# Altium schematic sheet BHS_Circuit.SchDoc
size A4; SheetNumber: 1; SheetTotal: 1
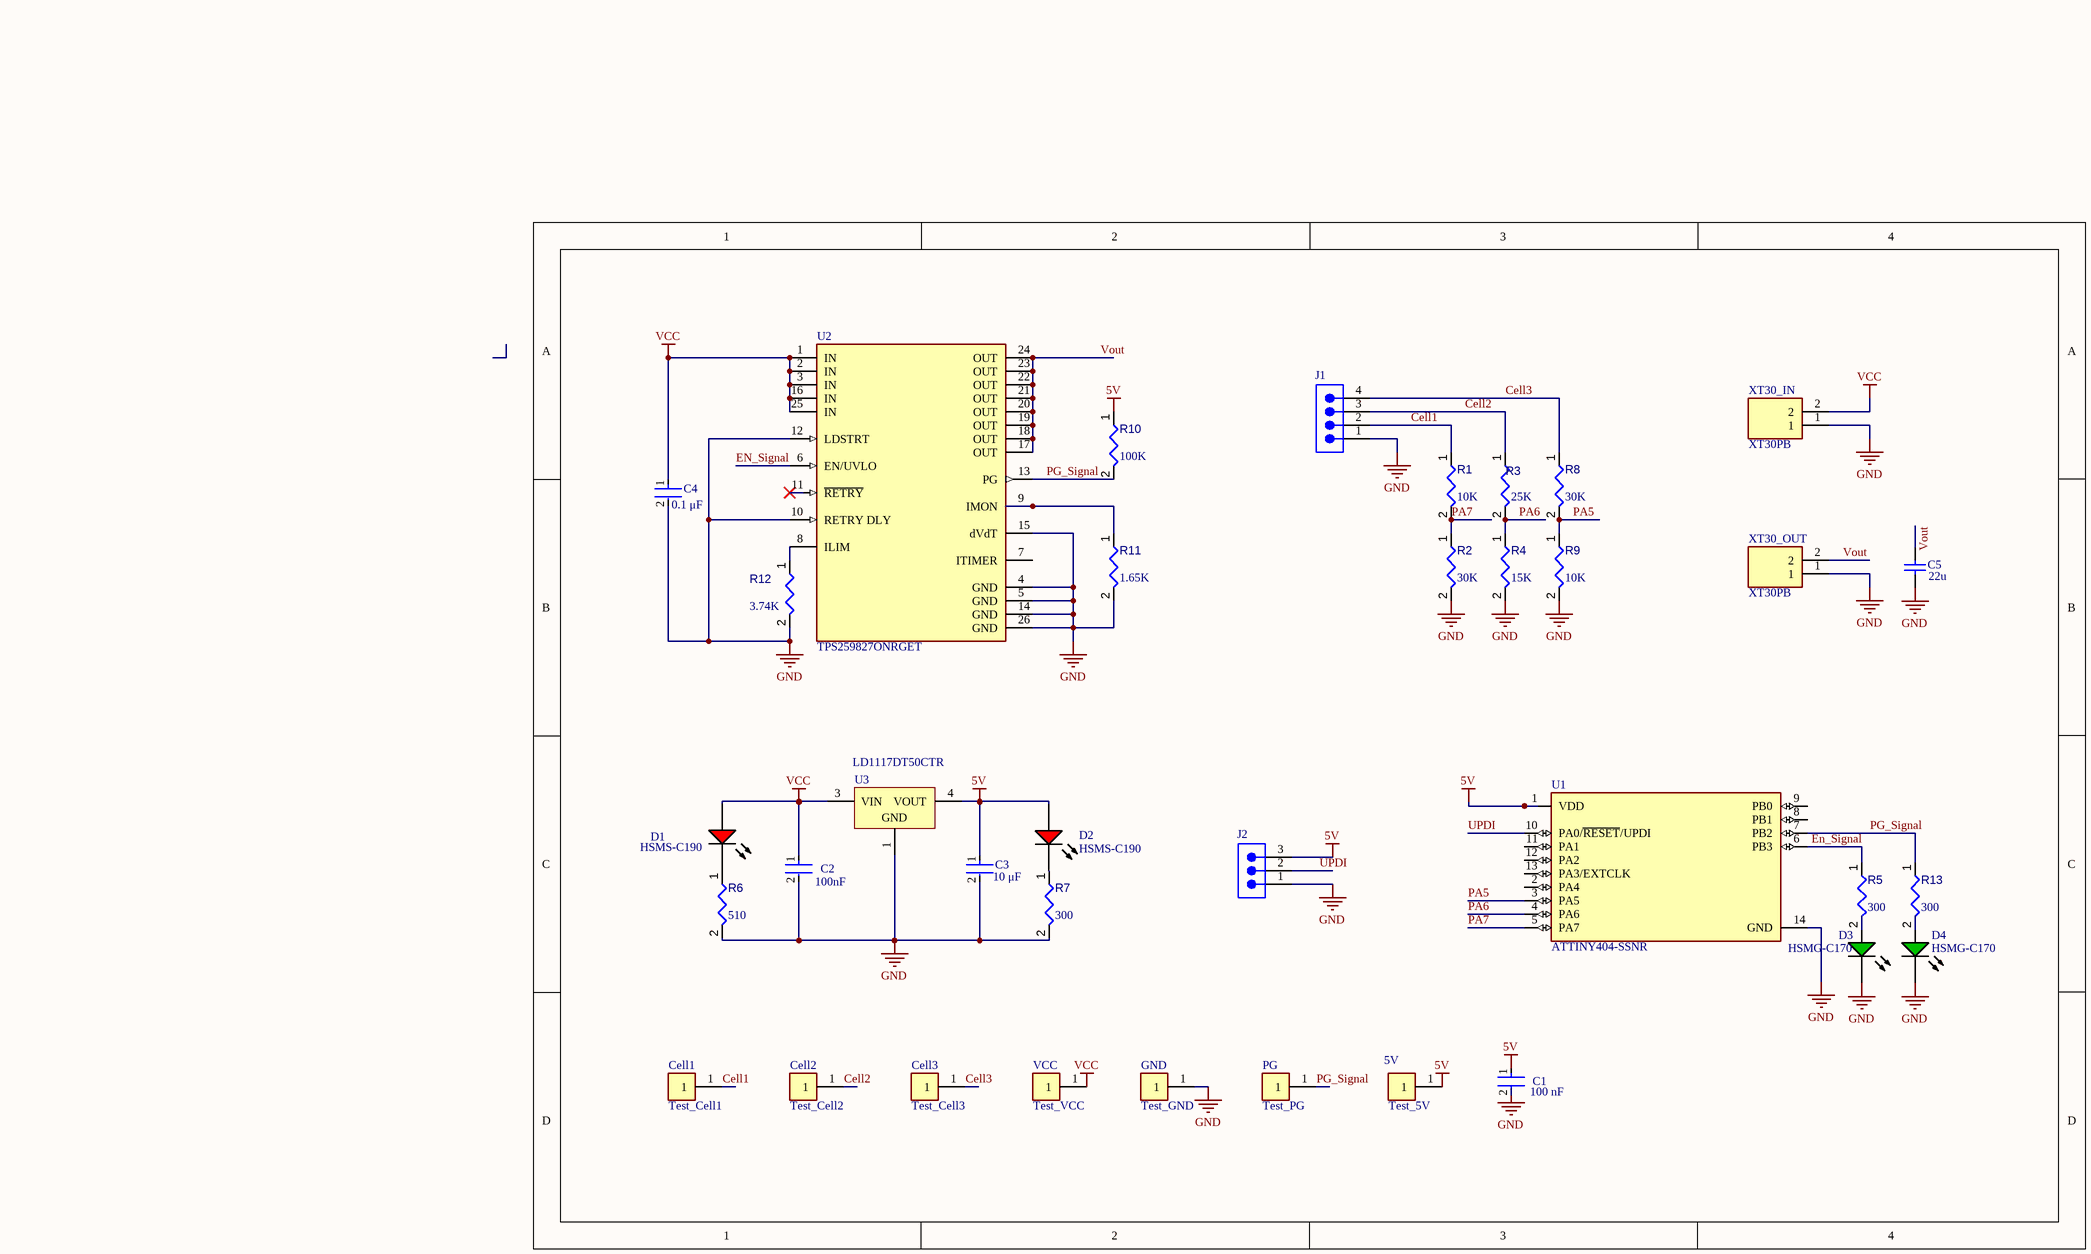
[diagram p0: BHS_Circuit.SchDoc]

## Parts
5V  Test_5V  [FP-5001-MFG]
C1  value 100 nF  [FP-C0805C-DN-MFG]  (hidden comment: CL21B104KBCNNNC)
C2  value 100nF  [FP-C0805C-DN-MFG]  (hidden comment: CL21B104KBCNNNC)
C3  value 10 μF  [FP-C0805C-DN-MFG]  (hidden comment: CL21A106KOQNNNE)
C4  value 0.1 μF  [FP-C0805C-DN-MFG]  (hidden comment: CL21B104KBCNNNC)
C5  Part Number: 22u  [CAPC2014X150X70NL20]  (hidden comment: CL21A226MOCLRNC)
Cell1  Test_Cell1  [FP-5001-MFG]
Cell2  Test_Cell2  [FP-5001-MFG]
Cell3  Test_Cell3  [FP-5001-MFG]
D1  HSMS-C190  [AVAG-HSMX-C190_V]
D2  HSMS-C190  [AVAG-HSMX-C190_V]
D3  HSMG-C170  [AVAG-HSMX-C170_V]
D4  HSMG-C170  [AVAG-HSMX-C170_V]
GND  Test_GND  [FP-5001-MFG]
J1  (no value)  [61300411121]
J2  (no value)  [61300311121]
PG  Test_PG  [FP-5001-MFG]
R1  value 10K  [RESC0805(2012)_L]  (hidden comment: RMCF0805FT10K0)
R2  value 30K  [RESC0805(2012)_L]  (hidden comment: RC0805DR-0730KL)
R3  value 25K  [RESC0805(2012)_L]
R4  value 15K  [RESC0805(2012)_L]  (hidden comment: SR0805JR-0715KL)
R5  value 300  [RESC0805(2012)_L]  (hidden comment: ERJ6GEYJ301V)
R6  value 510  [RESC0805(2012)_L]  (hidden comment: CR-05JA7--510R)
R7  value 300  [RESC0805(2012)_L]  (hidden comment: ERJ6GEYJ301V)
R8  value 30K  [RESC0805(2012)_L]  (hidden comment: RC0805DR-0730KL)
R9  value 10K  [RESC0805(2012)_L]  (hidden comment: RMCF0805FT10K0)
R10  value 100K  [RESC0805(2012)_L]  (hidden comment: RMCF0805FT100K)
R11  value 1.65K  [RESC0805(2012)_L]
R12  value 3.74K  [RESC0805(2012)_L]  (hidden comment: RC0805FR-073K74L)
R13  value 300  [RESC0805(2012)_L]  (hidden comment: ERJ6GEYJ301V)
U1  ATTINY404-SSNR  [FP-C04-065-D3X-IPC_C]
U2  TPS259827ONRGET  [FP-RGE0024M-MFG]
U3  LD1117DT50CTR  [TO-252_N]
VCC  Test_VCC  [FP-5001-MFG]
XT30_IN  XT30PB  [XT30PB]
XT30_OUT  XT30PB  [XT30PB]

## Nets
5V: 5V.1 C1.1 C3.1 D2.1(A) J2.3 R10.1 U1.1(VDD) U3.4(VOUT)
GND: C1.2 C2.2 C3.2 C4.2 C5.1 D3.2(K) D4.2(K) GND.1 J1.1 J2.1 R2.2 R4.2 R6.2 R7.2 R9.2 R11.2 R12.2 U1.14(GND) U2.4(GND) U2.5(GND) U2.10(RETRY_DLY) U2.12(LDSTRT) U2.14(GND) U2.15(dVdT) U2.26(GND) U3.1(GND) XT30_IN.1 XT30_OUT.1
VCC: C2.1 C4.1 D1.1(A) U2.1(IN) U2.2(IN) U2.3(IN) U2.16(IN) U2.25(IN) U3.3(VIN) VCC.1 XT30_IN.2
Cell1: Cell1.1 J1.2 R1.1
Cell2: Cell2.1 J1.3 R3.1
Cell3: Cell3.1 J1.4 R8.1
EN_Signal: R5.1 U1.6(PB3) U2.6(EN/UVLO)
PA5: R8.2 R9.1 U1.3(PA5)
PA6: R3.2 R4.1 U1.4(PA6)
PA7: R1.2 R2.1 U1.5(PA7)
PG_Signal: PG.1 R10.2 R13.1 U1.7(PB2) U2.13(PG)
UPDI: J2.2 U1.10(PA0/~{RESET}/UPDI)
Vout: C5.2 U2.17(OUT) U2.18(OUT) U2.19(OUT) U2.20(OUT) U2.21(OUT) U2.22(OUT) U2.23(OUT) U2.24(OUT) XT30_OUT.2
NetD1_2: D1.2(K) R6.1
NetD2_2: D2.2(K) R7.1
NetD3_1: D3.1(A) R5.2
NetD4_1: D4.1(A) R13.2
NetR11_1: R11.1 U2.9(IMON)
NetR12_1: R12.1 U2.8(ILIM)

Not connected (* = marked no-connect by the designer): U1 2(PA4) 8(PB1) 9(PB0) 11(PA1) 12(PA2) 13(PA3/EXTCLK); U2 7(ITIMER) 11(~{RETRY})*

## Notes on the sheet
- Type @ to refer to a designator or a net

## Library data of the parts
5V Cell1-Cell3 GND PG VCC = CMP-2000-05181-2: PC TEST POINT MINIATURE BLACK; Body Material: Bronze; Plating: Silver; Inside Diameter: 1.27mm; Hole Diameter: 1.6mm; Number of Ports: 1; Outside Diameter: 2.54mm; Insulation: Insulated; Insulation Material: Nylon; Mount: Through Hole; RoHS Compliant: Yes; Series: THM; Height: 0.3inch; Termination: Through Hole; Material: Nylon; Packaging: Bulk; Contact Material: Bronze; REACH SVHC: No SVHC; Contact Plating: Silver; Orientation: Straight; Lead Free: Lead Free; Package Quantity: 100; Length: 7.62mm; Flammability Rating: UL94 V-0; Number of Contacts: 1; Diameter: 2.54mm; Housing Color: Black; Color: Black
C1 C2 = CMP-1036-04552-2: Manufacturer: KEMET; Manufacturer Part Number: C0805C224K5RACTU; Temperature Characteristic: X7R; Temperature Coefficient: 30ppm/°C; Capacitance: 0.22 μF; Material: Ceramic; Tolerance: 0.1; Voltage Rating: 50 V; ComponentLink2URL: https://content.kemet.com/datasheets/KEM_C1003_C0G_SMD.pdf; Device Class L3: Ceramic Capacitors; Lead Free: Yes; Temperature: -55°C to +125°C; RoHS: TRUE; Automotive: No; Octopart: https://octopart.com/c0805c224k5ractu-kemet-144670; Temperature Range Low: -55°C; Height: 0.88mm; Device Class L1: Passive Components; Digikey Description: CAP CER 0.22UF 50V X7R 0805; ComponentLink2Description: Datasheet; Mouser Description: CAP CER 0.22UF 50V X7R 0805; Category: Cap; Ipc Land Pattern Name: CAPC200125X78; Temperature Range High: +125°C; Package: C0805C-DN; Device Class L2: Capacitors
C3 = CMP-1036-04552-2: 16V 10uF X5R ±10% 0805 Multilayer Ceramic Capacitors MLCC - SMD/SMT ROHS; Manufacturer: KEMET; Manufacturer Part Number: C0805C224K5RACTU; Temperature Characteristic: X7R; Temperature Coefficient: 30ppm/°C; Capacitance: 0.22 μF; Tolerance: 0.1; Voltage Rating: 50 V; ComponentLink2URL: https://content.kemet.com/datasheets/KEM_C1003_C0G_SMD.pdf; Device Class L3: Ceramic Capacitors; Lead Free: Yes; Temperature: -55°C to +125°C; RoHS: TRUE; Automotive: No; Material: Ceramic; Octopart: https://octopart.com/c0805c224k5ractu-kemet-144670; Temperature Range Low: -55°C; Height: 0.88mm; Device Class L1: Passive Components; Digikey Description: CAP CER 0.22UF 50V X7R 0805; ComponentLink2Description: Datasheet; Mouser Description: CAP CER 0.22UF 50V X7R 0805; Category: Cap; Ipc Land Pattern Name: CAPC200125X78; Temperature Range High: +125°C; Package: C0805C-DN; Device Class L2: Capacitors
C4 = CMP-1036-04552-2: CAP CER 0.22UF 50V X7R 0805; Manufacturer: KEMET; Manufacturer Part Number: C0805C224K5RACTU; Temperature Coefficient: 30ppm/°C; Capacitance: 0.22 μF; Material: Ceramic; Tolerance: 0.1; ComponentLink2URL: https://content.kemet.com/datasheets/KEM_C1003_C0G_SMD.pdf; Temperature Characteristic: X7R; Device Class L3: Ceramic Capacitors; Lead Free: Yes; Temperature: -55°C to +125°C; RoHS: TRUE; Automotive: No; Octopart: https://octopart.com/c0805c224k5ractu-kemet-144670; Temperature Range Low: -55°C; Height: 0.88mm; Device Class L1: Passive Components; Digikey Description: CAP CER 0.22UF 50V X7R 0805; ComponentLink2Description: Datasheet; Mouser Description: CAP CER 0.22UF 50V X7R 0805; Category: Cap; Ipc Land Pattern Name: CAPC200125X78; Temperature Range High: +125°C; Package: C0805C-DN; Device Class L2: Capacitors; Voltage Rating: 50 V
C5 = CMP-2007-00022-1: Manufacturer: AVX Interconnect / Elco
D1 D2 = CMP-2000-06427-1: LED Uni-Color Red, 52 mW, 20 mA, -40 to 85 degC, 2-Pin SMD, RoHS, Tape and Reel; Manufacturer: Avago; Reverse Voltage: 5V; Viewing Angle: 170deg; High Brightness: No; Lens Type: ColorlessDiffused; DELETED: Compliant; Product Height (mm): 0.8mm; Dominant Wave Length: 626nm; Number of  Elements: 1; Chip Material: GaP; Lum Intensity: 10mcd; Product Length (mm): 1.6mm; Forward Voltage: 2.6V; Power Dissipation: 52W; Shape Type: Rectangular; Forward Current: 25mA; Peak Wavelength: 630nm; Test Current (It): 20mA; Main Category: ChipLED; Lens Dimensions: 1x0.8x0.5mm; Pin Count: 2; Package Reference: HSMX-C190; Mounting Technology: SurfaceMount; Mounting: SurfaceMount; Datasheet URL: http://docs.avagotech.com/docs/AV02-0551EN; Package Type: ChipLed; Operating Temperature Classification: Industrial; Datasheet Version: 03/2012; Operating Temp Range: -40Cto85C; Emitting Color: Red; Rad Hardened: No; Manufacturer URL: http://www.avagotech.com/; Luminous Intensity: 10mcd; Package Description: 2-Pin Surface Mount Device, Body 1.6 x 0.8 mm, Height 0.9 mm; Type: Uni-Color; Packaging: TapeandReel; Product Depth (mm): 0.8mm
D3 D4 = CMP-2000-05062-1: Chip LED, Green, 2.2 V, -40 to 85 degC, 2-Pin SMD, Pb-Free, Tape and Reel; Manufacturer: Avago; No. of Pins: 2; Peak Wavelength: 570nm; SVHC: NoSVHC(16-Jun-2014); Dominant Wavelength: 572nm; Forward Current If: 20mA; Viewing Angle: 170deg; Lens Shape: Rectangular; PIV Max: 5V; External Width: 1.25mm; LED Type: Standard; External Depth: 0.8mm; Opto Mounting Orientation: Top; Luminous Intensity: 15mcd; Luminous Intensity Min: 4mcd; Forward Voltage VF Max: 2.6V; External Length / Height: 2mm; Bulb Size: 1.25mmx1.4mm; Light Area Height: 1mm; Voltage Vf Typ: 2.2V; Operating Temperature Max: 85degC; Datasheet Version: Oct-08; MSL: MSL2A-4weeks; Peak Forward Current: 20mA; Package Description: 2-Pin Surface Mount Device, Body 2 x 1.25 mm, Height 0.8 mm; Datasheet URL: https://datasheet.ciiva.com/29280/180495-da-01-en-chip-led-hsmg-c170-gelb-gruen-29280971.pdf; Storage Temperature Min: -40degC; LED Colour: Green; Wavelength Typ: 570nm; Mounting Type: SMD; Forward Current If Max: 20mA; Dominant Wavelength Typ: 572nm; LED Mounting: SMD; Operating Temperature Range: -30degCto+85degC; Operating Temperature Min: -30degC; Manufacturer URL: http://www.avagotech.com/; Packaging: CutTape; Luminous Intensity Typ: 15mcd; Package Reference: HSMX-C170; Storage Temperature Max: 85degC; Opto Case Style: SMD; Forward Voltage: 2.2V
J1 = CMP-1502-01064-2: NexarPartId: 32855522; Pitch: 2.54mm; Number of Contacts: 4; Contact Resistance: 20mΩ; Gender: Male; Current Rating: 3A; Connector Type: Male Pin; Voltage Rating: 250V; Lead Free: Lead Free; Contact Plating: Gold; Max Operating Temperature: 105°C; Packaging: Bulk; Height: 8.89mm; Orientation: Vertical; Contact Mating Length: 5.9944mm; Contact Material: Copper; Lead Pitch: 2.54mm; Min Operating Temperature: -40°C; Termination: Solder; Color: Black; Number of Rows: 1; REACH SVHC: Unknown; RoHS: Compliant; Mount: Through Hole; Number of Positions: 4; Number of Pins: 4; Operating Supply Voltage: 250V
J2 = CMP-1502-01062-2: NexarPartId: 32855521; Voltage Rating: 250V; Current Rating: 3A; Connector Type: Male Pin; Number of Positions: 3; Gender: Male; Contact Resistance: 20mΩ; Pitch: 2.54mm; Max Operating Temperature: 105°C; Lead Pitch: 2.54mm; Lead Free: Lead Free; Contact Mating Length: 5.9944mm; Contact Material: Copper; Number of Pins: 3; Orientation: Vertical; Height: 8.94mm; Packaging: Bulk; Min Operating Temperature: -40°C; Mount: Through Hole; RoHS: Compliant; Number of Contacts: 3; Operating Supply Voltage: 250V; Termination: Solder; Number of Rows: 1; Contact Plating: Gold; Color: Black; REACH SVHC: Unknown
R1-R13 = CMP-009-00076-2: Tolerance: 5%; Power: 125mW; Pins: 2; Mounting Technology: SMT; Case/Package: 0805
U1 = CMP-06276-000148-1: IC MCU 8BIT 4KB FLASH 14SOIC
U2 = CMP-04913-000042-1: PWR MGMT PWR DISTRIBUTION
U3 = CMP-0244-00109-1: Fixed Low Drop Positive Voltage Regulator, 5V, 3-Pin DPAK, Tape and Reel; ComponentLink2URL: http://www.st.com/internet/com/TECHNICAL_RESOURCES/TECHNICAL_LITERATURE/DATASHEET/CD00000544.pdf; ComponentLink1URL: http://www.st.com; PackageReference: TO-252; DatasheetVersion: 1/11/2011; ComponentLink1Description: Manufacturer URL; PackageVersion: 2011; ComponentLink2Description: Datasheet; PackageDescription: 3-Pin Transistor Outline Package 2.28 mm Pitch, 9.7 mm Lead Span (DPAK)
XT30_IN XT30_OUT = CMP-002-00071-1: Mini XT60 XT30 Connector for RC Multirotor Racing Drone Quadcopter; Manufacturer_Name: Amass; Geometry.Height: 10.7mm; Datasheet Link: https://www.tme.eu/Document/4acc913878197f8c2e30d4b8cdc47230/XT30UPB%20SPEC.pdf; Arrow Part Number: *; Design Item ID: XT30PB; Arrow Price/Stock: *; Mouser Price/Stock: *; Source: XT30PB.SchLib; Mouser Part Number: *; Manufacturer_Part_Number: XT30PB